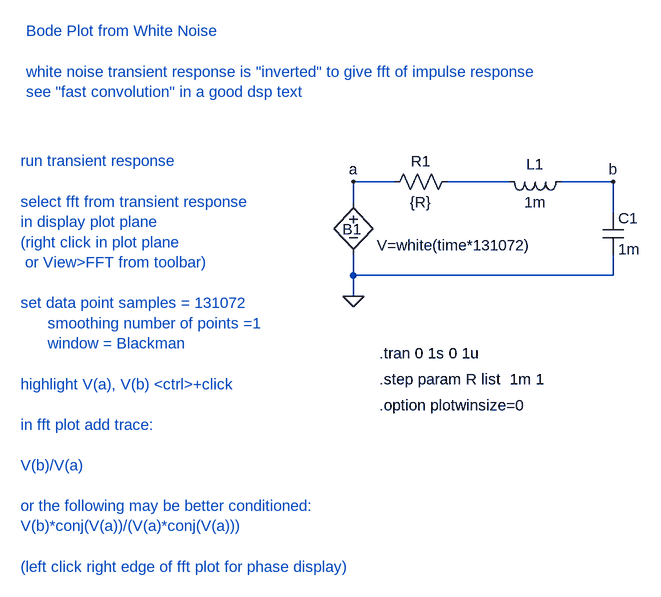
[diagram p0: schematic Noise_to_Bode.asc]
Noise_to_Bode.asc, the LTspice schematic file:
Version 4
SHEET 1 1724 868
WIRE 224 272 224 240
WIRE 224 384 224 352
WIRE 224 416 224 384
WIRE 288 240 224 240
WIRE 464 240 368 240
WIRE 624 240 544 240
WIRE 624 288 624 240
WIRE 624 384 224 384
WIRE 624 384 624 352
FLAG 224 416 0
FLAG 224 240 a
FLAG 624 240 b
SYMBOL cap 608 288 R0
SYMATTR InstName C1
SYMATTR Value 1m
SYMBOL res 384 224 R90
WINDOW 0 0 56 VBottom 0
WINDOW 3 32 56 VTop 0
SYMATTR InstName R1
SYMATTR Value {R}
SYMBOL bv 224 256 R0
WINDOW 3 36 82 Left 0
WINDOW 0 -17 57 Left 0
SYMATTR Value V=white(time*131072)
SYMATTR InstName B1
SYMBOL ind 560 224 R90
WINDOW 0 5 56 VBottom 0
WINDOW 3 32 56 VTop 0
SYMATTR InstName L1
SYMATTR Value 1m
TEXT 264 544 Left 0 !.step param R list  1m 1
TEXT 264 504 Left 0 !.tran 0 1s 0 1u
TEXT 264 584 Left 0 !.option plotwinsize=0
TEXT -288 208 Left 0 ;run transient response\n \nselect fft from transient response\nin display plot plane\n(right click in plot plane\n or View>FFT from toolbar)\n \nset data point samples = 131072\n      smoothing number of points =1\n      window = Blackman\n \nhighlight V(a), V(b) <ctrl>+click\n \nin fft plot add trace:\n \nV(b)/V(a)\n \nor the following may be better conditioned:\nV(b)*conj(V(a))/(V(a)*conj(V(a)))\n \n(left click right edge of fft plot for phase display)
TEXT -280 8 Left 0 ;Bode Plot from White Noise\n \nwhite noise transient response is "inverted" to give fft of impulse response\nsee "fast convolution" in a good dsp text

The netlist it stands for:
* Noise_to_Bode.asc
C1 b 0 1m
R1 N001 a {R}
B1 a 0 V=white(time*131072)
L1 b N001 1m
.step param R list  1m 1
.tran 0 1s 0 1u
.option plotwinsize=0
* run transient response
* select fft from transient response
* in display plot plane
* (right click in plot plane
*  or View>FFT from toolbar)
* set data point samples = 131072
*       smoothing number of points =1
*       window = Blackman
* highlight V(a), V(b) <ctrl>+click
* in fft plot add trace:
* V(b)/V(a)
* or the following may be better conditioned:
* V(b)*conj(V(a))/(V(a)*conj(V(a)))
* (left click right edge of fft plot for phase display)
* Bode Plot from White Noise
* white noise transient response is "inverted" to give fft of impulse response
* see "fast convolution" in a good dsp text
.backanno
.end